# EAGLE design FNIRS_Carrier_BT_Series (EAGLE 9.6.2)

## Sheet 1 of 3
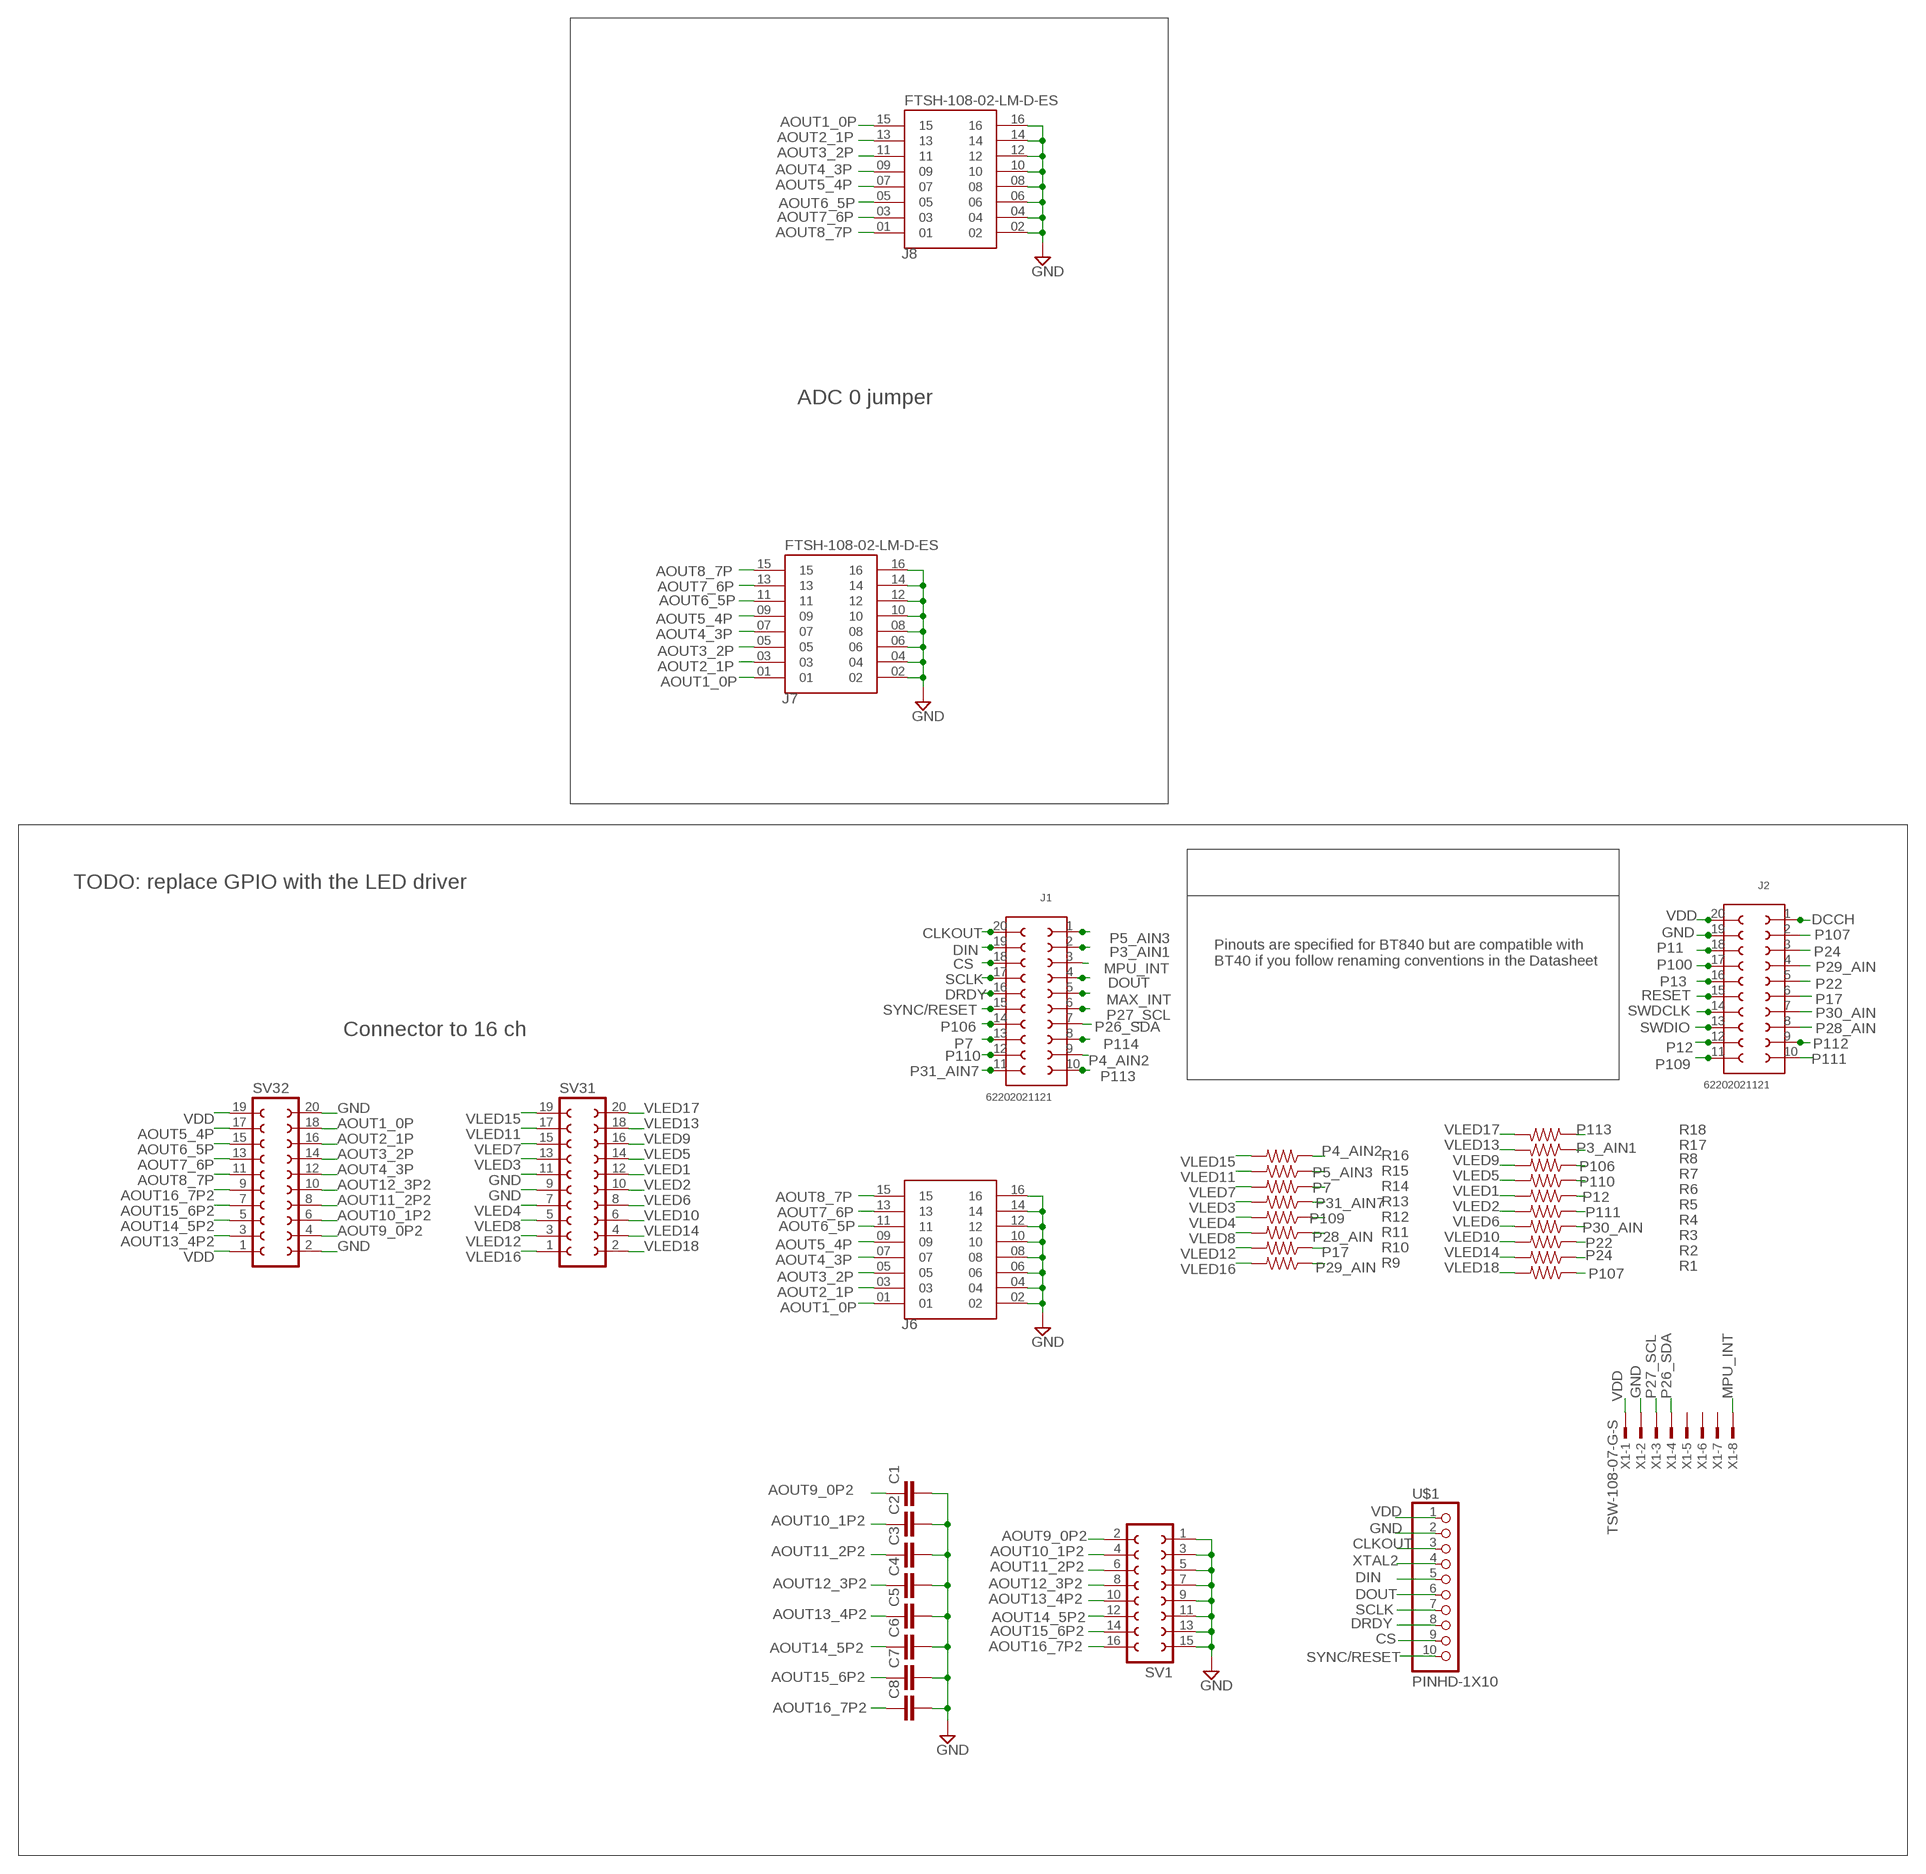
[diagram p0: schematic, sheet 1]

### Parts
C1  C2.5/2  [C2.5-2]
C2  C2.5/2  [C2.5-2]
C3  C2.5/2  [C2.5-2]
C4  C2.5/2  [C2.5-2]
C5  C2.5/2  [C2.5-2]
C6  C2.5/2  [C2.5-2]
C7  C2.5/2  [C2.5-2]
C8  C2.5/2  [C2.5-2]
J1  62202021121  [62202021121]
J2  62202021121  [62202021121]
J6  FTSH-108-02-LM-D-ES  [SAMTEC_FTSH-108-02-LM-D-ES]
J7  FTSH-108-02-LM-D-ES  [SAMTEC_FTSH-108-02-LM-D-ES]
J8  FTSH-108-02-LM-D-ES  [SAMTEC_FTSH-108-02-LM-D-ES]
R1  R-US_0204/5  [0204/5]
R2  R-US_0204/5  [0204/5]
R3  R-US_0204/5  [0204/5]
R4  R-US_0204/5  [0204/5]
R5  R-US_0204/5  [0204/5]
R6  R-US_0204/5  [0204/5]
R7  R-US_0204/5  [0204/5]
R8  R-US_0204/5  [0204/5]
R9  R-US_0204/5  [0204/5]
R10  R-US_0204/5  [0204/5]
R11  R-US_0204/5  [0204/5]
R12  R-US_0204/5  [0204/5]
R13  R-US_0204/5  [0204/5]
R14  R-US_0204/5  [0204/5]
R15  R-US_0204/5  [0204/5]
R16  R-US_0204/5  [0204/5]
R17  R-US_0204/5  [0204/5]
R18  R-US_0204/5  [0204/5]
SV1  FE08-2  [FE08-2]
SV31  FE10-2  [FE10-2]
SV32  FE10-2  [FE10-2]
U$1  PINHD-1X10  [1X10-BIG]
X1  TSW-108-07-G-S  [TSW-108-XX-G-S]

### Nets
AOUT1_0P: J6.01 J7.01 J8.15 SV32.18
AOUT2_1P: J6.03 J7.03 J8.13 SV32.16
AOUT3_2P: J6.05 J7.05 J8.11 SV32.14
AOUT4_3P: J6.07 J7.07 J8.09 SV32.12
AOUT5_4P: J6.09 J7.09 J8.07 SV32.17
AOUT6_5P: J6.11 J7.11 J8.05 SV32.15
AOUT7_6P: J6.13 J7.13 J8.03 SV32.13
AOUT8_7P: J6.15 J7.15 J8.01 SV32.11
AOUT9_0P2: C1.1 SV1.2 SV32.4
AOUT10_1P2: C2.1 SV1.4 SV32.6
AOUT11_2P2: C3.1 SV1.6 SV32.8
AOUT12_3P2: C4.1 SV1.8 SV32.10
AOUT13_4P2: C5.1 SV1.10 SV32.3
AOUT14_5P2: C6.1 SV1.12 SV32.5
AOUT15_6P2: C7.1 SV1.14 SV32.7
AOUT16_7P2: C8.1 SV1.16 SV32.9
CLKOUT: J1.20 U$1.3
CS: J1.18 U$1.9
DCCH: J2.1
DIN: J1.19 U$1.5
DOUT: J1.4 U$1.6
DRDY: J1.16 U$1.8
GND: C1.2 C2.2 C3.2 C4.2 C5.2 C6.2 C7.2 C8.2 J2.19 J6.02 J6.04 J6.06 J6.08 J6.10 J6.12 J6.14 J6.16 J7.02 J7.04 J7.06 J7.08 J7.10 J7.12 J7.14 J7.16 J8.02 J8.04 J8.06 J8.08 J8.10 J8.12 J8.14 J8.16 SV1.1 SV1.3 SV1.5 SV1.7 SV1.9 SV1.11 SV1.13 SV1.15 SV31.9 SV31.11 SV32.2 SV32.20 U$1.2 X1.2
MAX_INT: J1.5
MPU_INT: J1.3 X1.8
P3_AIN1: J1.2 R17.1
P4_AIN2: J1.9 R16.1
P5_AIN3: J1.1 R15.1
P7: J1.13 R14.1
P11: J2.18
P12: J2.12 R6.1
P13: J2.16
P17: J2.6 R10.1
P22: J2.5 R3.1
P24: J2.3 R2.1
P26_SDA: J1.7 X1.4
P27_SCL: J1.6 X1.3
P28_AIN: J2.8 R11.1
P29_AIN: J2.4 R9.1
P30_AIN: J2.7 R4.1
P31_AIN7: J1.11 R13.1
P100: J2.17
P106: J1.14 R8.1
P107: J2.2 R1.1
P109: J2.11 R12.1
P110: J1.12 R7.1
P111: J2.10 R5.1
P112: J2.9
P113: J1.10 R18.1
P114: J1.8
RESET: J2.15
SCLK: J1.17 U$1.7
SWDCLK: J2.14
SWDIO: J2.13
SYNC/RESET: J1.15 U$1.10
VDD: J2.20 SV32.1 SV32.19 U$1.1 X1.1
VLED1: R6.2 SV31.12
VLED2: R5.2 SV31.10
VLED3: R13.2 SV31.13
VLED4: R12.2 SV31.7
VLED5: R7.2 SV31.14
VLED6: R4.2 SV31.8
VLED7: R14.2 SV31.15
VLED8: R11.2 SV31.5
VLED9: R8.2 SV31.16
VLED10: R3.2 SV31.6
VLED11: R15.2 SV31.17
VLED12: R10.2 SV31.3
VLED13: R17.2 SV31.18
VLED14: R2.2 SV31.4
VLED15: R16.2 SV31.19
VLED16: R9.2 SV31.1
VLED17: R18.2 SV31.20
VLED18: R1.2 SV31.2
XTAL2: U$1.4
Unconnected: X1.5 X1.6 X1.7

### Notes on the sheet
- ADC 0 jumper
- TODO: replace GPIO with the LED driver
- Pinouts are specified for BT840 but are compatible with 
  BT40 if you follow renaming conventions in the Datasheet
- Connector to 16 ch

## Sheet 2 of 3

## Sheet 3 of 3

## Library data of the parts
C1-C8 = capacitor-wima:C: CAPACITOR naming: grid - package width
J1 J2 = 2x10_1.27mm:62202021121: WR-PHD 1.27mm Dual Pin Header, 20 Pins=>Code : Con_BTB_PHD_1.27_2_62202021121 <http://katalog.we-online.de/media/thumbs2/eican/thb_Con_BTB_PHD_1.27_2_6220xx21121_pf2.jpg> Details see: http://katalog.we-online.de/en/em/622_0xx_211_21 Created 2014-06-03, Karrer Zheng 2014 (C) Würth Elektronik Check availability <https://pricing.snapeda.com/parts/62202021121/W%C3%BCrth%20Elektronik/view-part?ref=eda>; AVAILABILITY: In Stock; DESCRIPTION: Connector Header Through Hole 20 position 0.050 (1.27mm); MF: Würth Elektronik; MP: 62202021121; PACKAGE: None; PRICE: None; PURCHASE-URL: https://pricing.snapeda.com/search/part/62202021121/?ref=eda
J6-J8 = 16pos1.27mm:FTSH-108-02-LM-D-ES: Check availability <https://pricing.snapeda.com/parts/FTSH-108-02-LM-D-ES/Samtec/view-part?ref=eda>; AVAILABILITY: In Stock; DESCRIPTION: Connector Header Through Hole 16 position 0.050 (1.27mm); MF: Samtec; MP: FTSH-108-02-LM-D-ES; PACKAGE: None; PRICE: None; PURCHASE-URL: https://pricing.snapeda.com/search?q=FTSH-108-02-LM-D-ES&ref=eda
R1-R18 = rcl:R-US_: RESISTOR, American symbol; SPICEPREFIX: R
SV1 = con-lsta:FE08-2: FEMALE HEADER; OC_FARNELL: unknown; OC_NEWARK: unknown
SV31 SV32 = con-lsta:FE10-2: FEMALE HEADER; OC_FARNELL: unknown; OC_NEWARK: unknown
U$1 = adafruit:PINHD-1X10: Pin header 1x10 0.1" spacing With round pins
X1 = con-samtec:TSW-108-*-G-S: THROUGH-HOLE .025" SQ POST HEADER Source: Samtec TSW.pdf; MF: Samtec Inc.; MPN: TSW-108-07-G-S

## Board
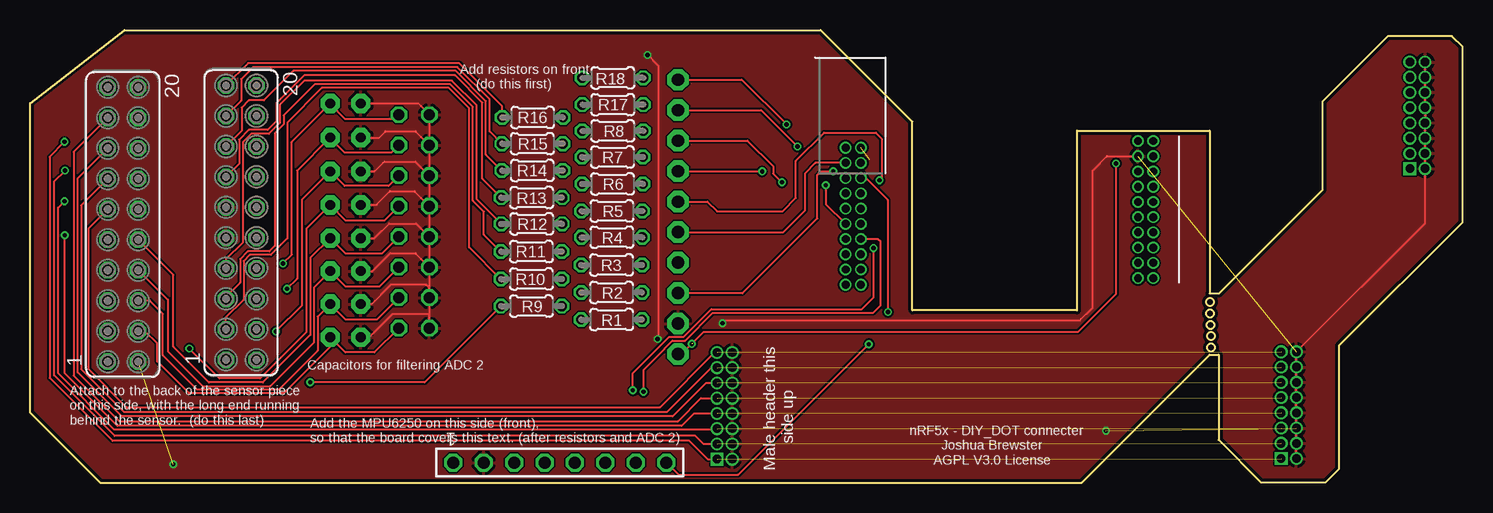
[diagram p1: board, top side]
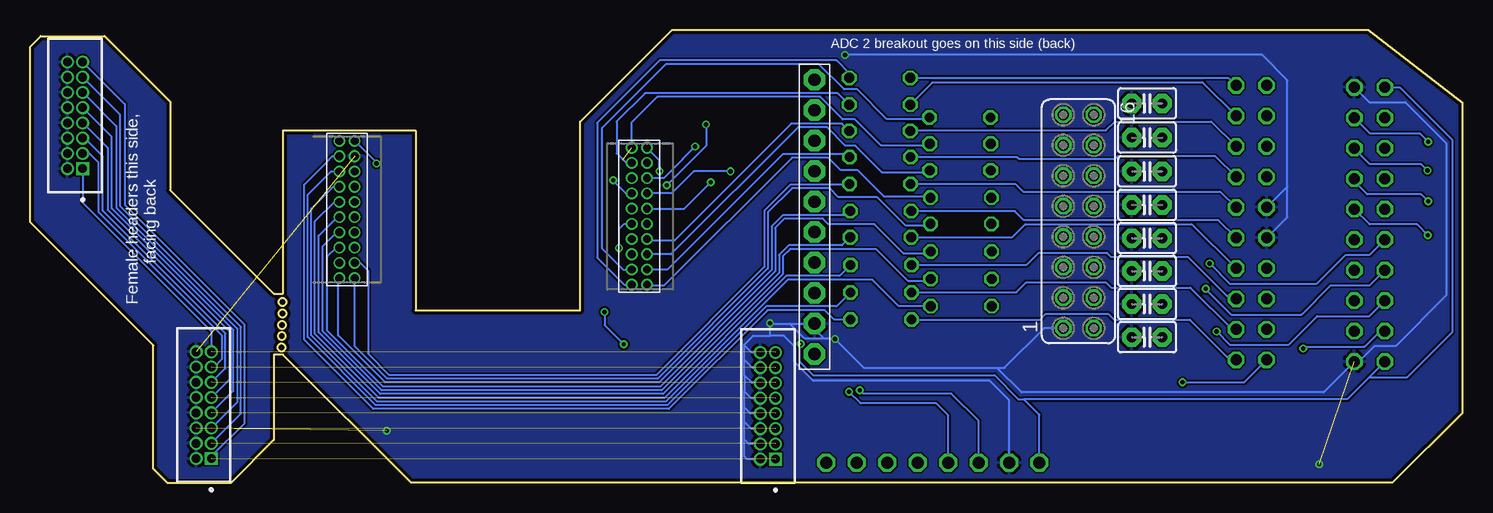
[diagram p2: board, bottom side, seen from below]

Size 119.38 x 37.72 mm. Coordinates in mm from the lower left corner, seen from the top.
Outline: 0,31.62 7.87,37.72 65.89,37.72 73.53,30.07 73.53,14.35 87.25,14.35 87.25,29.34 98.3,29.34 98.3,15.75 99.06,15.75 107.7,24.38 107.7,31.75 113.16,37.21 118.49,37.21 119.38,36.32 119.38,21.72 109.09,11.43 109.09,1.14 107.95,0 102.62,0 99.06,3.56 99.06,10.67 98.3,10.67 87.63,0 5.84,0 0,5.84 0,31.62
Outline: circle at 98.32,15.06 radius 0.32
Outline: circle at 98.32,14.1 radius 0.32
Outline: circle at 98.37,13.13 radius 0.32
Outline: circle at 98.4,12.22 radius 0.32
Outline: circle at 98.42,11.28 radius 0.32
Copper layers (1*16): Top 0.035mm / dielectric 1.5mm / Bottom 0.035mm
Design rules "default *": minimum track width 4mil, minimum drill 0.2mm, track to track 6mil, track to pad 6mil, pad to pad 6mil, via to via 6mil, smd to smd 6mil, copper to edge 10mil, drill to drill 6mil, minimum pad ring 6mil, minimum via ring 6mil, stop-mask expansion 4mil, vias tented up to drill 20mil, thermal gap 10mil

### Footprints (pad centres in the part's own frame; a part is rotated, then mirrored left to right if it is on the bottom)
C2.5-2 = drill 0.813 pad 1.6 octagon: 1 -1.27,0; 2 1.27,0
62202021121 = drill 0.65: 1 -5.715,-0.635; 2 -4.445,-0.635; 3 -3.175,-0.635; 4 -1.905,-0.635; 5 -0.635,-0.635; 6 0.635,-0.635; 7 1.905,-0.635; 8 3.175,-0.635; 9 4.445,-0.635; 10 5.715,-0.635; 11 5.715,0.635; 12 4.445,0.635; 13 3.175,0.635; 14 1.905,0.635; 15 0.635,0.635; 16 -0.635,0.635; 17 -1.905,0.635; 18 -3.175,0.635; 19 -4.445,0.635; 20 -5.715,0.635
SAMTEC_FTSH-108-02-LM-D-ES = drill 0.71 pad 1.06 square: 01 0,0 | drill 0.71 pad 1.06: 02 0,1.27; 03 1.27,0; 04 1.27,1.27; 05 2.54,0; 06 2.54,1.27; 07 3.81,0; 08 3.81,1.27; 09 5.08,0; 10 5.08,1.27; 11 6.35,0; 12 6.35,1.27; 13 7.62,0; 14 7.62,1.27; 15 8.89,0; 16 8.89,1.27
0204/5 = drill 0.813 octagon: 1 -2.54,0; 2 2.54,0
FE08-2 = drill 0.914 octagon: 1 -8.89,1.27; 2 -8.89,-1.27; 3 -6.35,1.27; 4 -6.35,-1.27; 5 -3.81,1.27; 6 -3.81,-1.27; 7 -1.27,1.27; 8 -1.27,-1.27; 9 1.27,1.27; 10 1.27,-1.27; 11 3.81,1.27; 12 3.81,-1.27; 13 6.35,1.27; 14 6.35,-1.27; 15 8.89,1.27; 16 8.89,-1.27
FE10-2 = drill 0.914 octagon: 1 -11.43,1.27; 2 -11.43,-1.27; 3 -8.89,1.27; 4 -8.89,-1.27; 5 -6.35,1.27; 6 -6.35,-1.27; 7 -3.81,1.27; 8 -3.81,-1.27; 9 -1.27,1.27; 10 -1.27,-1.27; 11 1.27,1.27; 12 1.27,-1.27; 13 3.81,1.27; 14 3.81,-1.27; 15 6.35,1.27; 16 6.35,-1.27; 17 8.89,1.27; 18 8.89,-1.27; 19 11.43,1.27; 20 11.43,-1.27
1X10-BIG = drill 1.016 pad 1.778 octagon: 1 -11.43,0; 2 -8.89,0; 3 -6.35,0; 4 -3.81,0; 5 -1.27,0; 6 1.27,0; 7 3.81,0; 8 6.35,0; 9 8.89,0; 10 11.43,0
TSW-108-XX-G-S = drill 1 pad 1.5 octagon: 1 8.89,0; 2 6.35,0; 3 3.81,0; 4 1.27,0; 5 -1.27,0; 6 -3.81,0; 7 -6.35,0; 8 -8.89,0

### Placement (x,y rotation side)
C1  26.29,12.12 180 bottom
C2  26.29,14.88 180 bottom
C3  26.29,17.63 180 bottom
C4  26.29,20.37 180 bottom
C5  26.29,23.14 180 bottom
C6  26.29,25.93 180 bottom
C7  26.29,28.75 180 bottom
C8  26.29,31.6 180 bottom
J1  68.61,22.2 270 bottom
J2  92.96,22.76 270 bottom
J6  57.25,1.96 90 bottom
J7  104.27,2.01 90 bottom
J8  114.99,26.16 90 bottom
R1  48.46,13.59 180 top
R2  48.46,15.85 180 top
R3  48.46,18.14 180 top
R4  48.49,20.45 180 top
R5  48.49,22.63 180 top
R6  48.54,24.89 180 top
R7  48.54,27.13 180 top
R8  48.56,29.31 180 top
R9  41.78,14.71 180 top
R10  41.78,16.97 180 top
R11  41.78,19.25 180 top
R12  41.81,21.56 180 top
R13  41.81,23.75 180 top
R14  41.86,26.01 180 top
R15  41.86,28.24 180 top
R16  41.88,30.43 180 top
R17  48.56,31.5 180 top
R18  48.56,33.73 180 top
SV1  32,21.77 90 bottom
SV31  17.6,21.67 90 top
SV32  7.75,21.51 90 top
U$1  54,22.15 90 bottom
X1  44.15,1.68 180 top

### Tracks (layer width: path | path; a pad name or v marks a point on that pad's centre or on a via)
AOUT1_0P  (via drill 0.35)  (1 unrouted)
  Top 0.152: v2.87,28.4 1.63,27.15 1.63,8.74 6.88,3.48 54.94,3.48 56.46,1.96 J6.01
  Bottom 0.152: SV32.18 7.72,29.11 3.58,29.11 v2.87,28.4 | J8.15 111.48,31.55 111.48,23.14 101.5,13.16 101.5,4.97 104.27,2.2 J7.01
AOUT2_1P  (via drill 0.35)  (1 unrouted)
  Top 0.152: v2.92,26.01 2.01,25.1 2.01,8.94 7.06,3.89 55.45,3.89 56.11,3.23 J6.03
  Bottom 0.152: v2.92,26.01 3.45,26.54 7.72,26.54 9.02,27.84 SV32.16 | J7.03 101.8,5.74 101.8,12.98 111.86,23.04 111.86,30.66 J8.13
AOUT3_2P  (via drill 0.35)  (1 unrouted)
  Top 0.152: v2.87,23.44 2.34,22.91 2.34,9.12 7.04,4.42 57.17,4.42 J6.05
  Bottom 0.152: v2.87,23.44 3.45,24.03 7.95,24.03 9.02,25.1 SV32.14 | J8.11 112.19,29.72 112.19,22.91 102.11,12.83 102.11,6.71 J7.05
AOUT4_3P  (via drill 0.35)  (1 unrouted)
  Top 0.152: v2.9,20.62 2.87,20.6 2.87,9.15 7.29,4.72 54.3,4.72 55.35,5.77 J6.07
  Bottom 0.152: v2.9,20.62 3.78,21.51 7.75,21.51 SV32.12 | J7.07 102.44,7.65 102.44,12.73 112.57,22.86 112.57,28.83 J8.09
AOUT5_4P  (1 unrouted)
  Top 0.152: SV32.17 3.63,27.56 3.63,8.92 7.42,5.13 54,5.13 55.9,7.04 J6.09
  Bottom 0.152: J8.07 112.9,27.89 112.9,22.73 102.77,12.6 102.77,8.59 J7.09
AOUT6_5P  (1 unrouted)
  Top 0.152: SV32.15 3.96,25.35 3.96,9.2 7.64,5.51 53.54,5.51 56.34,8.31 J6.11
  Bottom 0.152: J7.11 103.1,9.53 103.1,12.45 113.31,22.66 113.31,27.18 114.83,28.7 J8.05
AOUT7_6P  (1 unrouted)
  Top 0.152: SV32.13 4.27,23.11 4.27,9.45 7.82,5.89 53.09,5.89 56.77,9.58 J6.13
  Bottom 0.152: J8.03 114.43,27.43 113.69,26.7 113.69,22.58 103.4,12.29 103.4,10.26 104.04,9.63 J7.13
AOUT8_7P  (1 unrouted)
  Top 0.152: SV32.11 4.88,21.18 4.88,9.45 8.03,6.3 52.5,6.3 57.05,10.85 J6.15
  Bottom 0.152: J8.01 114.99,23.34 104.27,12.62 J7.15
AOUT9_0P2
  Top 0.152: SV32.4 9.58,12.62 10.59,11.61 10.59,10.11 13.26,7.44 21.16,7.44 25.02,11.3 C1.1 26.29,10.85 28.7,10.85 SV1.2
AOUT10_1P2
  Top 0.152: SV32.6 9.98,15.16 11.07,14.07 11.07,10.62 13.94,7.75 20.73,7.75 23.98,11 23.98,13.84 C2.1 26.31,13.59 28.91,13.59 SV1.4
AOUT11_2P2
  Top 0.152: SV32.8 11.48,15.24 11.48,10.95 14.38,8.05 20.02,8.05 23.67,11.71 23.67,16.28 C3.1 26.31,16.33 29.11,16.33 SV1.6
AOUT12_3P2
  Top 0.152: SV32.10 11.94,17.32 11.94,11.33 14.91,8.36 19.41,8.36 23.37,12.32 23.37,18.72 C4.1 26.31,19.08 29.31,19.08 SV1.8
AOUT13_4P2  (via drill 0.35)
  Top 0.152: v13.28,11.18 15.77,8.69 19.18,8.69 23.04,12.55 23.04,21.16 C5.1 26.31,21.84 29.54,21.84 SV1.10
  Bottom 0.152: v13.28,11.18 13.13,11.33 8.15,11.33 6.86,12.62 SV32.3
AOUT14_5P2  (via drill 0.35)
  Top 0.152: v20.5,12.6 22.66,14.76 22.66,23.57 C6.1 26.21,24.74 29.9,24.74 SV1.12
  Bottom 0.152: SV32.5 7.77,13.87 12.12,13.87 14.48,11.51 19.41,11.51 v20.5,12.6
AOUT15_6P2  (via drill 0.35)
  Top 0.152: C7.1 24.99,28.75 | 24.99,28.75 22.25,26.01 22.25,16.99 v21.41,16.15 | SV1.14 30.12,27.51 26.24,27.51 24.99,28.75
  Bottom 0.152: v21.41,16.15 21.41,16.13 19.28,14 13.41,14 10.97,16.43 7.75,16.43 SV32.7
AOUT16_7P2  (via drill 0.35)
  Top 0.152: SV1.16 30.38,30.3 26.29,30.3 25.02,31.57 C8.1 21.82,28.4 21.82,19 v21.08,18.26
  Bottom 0.152: v21.08,18.26 19.38,16.56 12.17,16.56 9.75,18.97 7.75,18.97 SV32.9
CLKOUT  (via drill 0.35)
  Top 0.152: U$1.3 54.03,15.77 59.36,15.77 65.61,22.02 65.61,25.63 65.92,25.94 v66.92,25.94
  Bottom 0.152: v66.92,25.94 66.92,26.87 J1.20
CS  (via drill 0.35)
  Top 0.152: U$1.9 60.93,31.04 v63.96,28.02
  Bottom 0.152: v63.96,28.02 65,26.98 65,26.95 66.57,25.38 J1.18
DIN
  Top 0.152: U$1.5 62.79,20.88 64.59,22.68 64.59,25.78 65.46,26.65 J1.19
DOUT  (via drill 0.35)
  Top 0.152: U$1.6 56.44,23.42 57.25,22.61 62.71,22.61 63.83,23.72 63.83,26.82 66.17,29.16 70.48,29.16 70.99,28.65 70.99,25.38 70.81,25.2 v70.79,25.2
  Bottom 0.152: J1.4 69.72,24.11 70.79,25.17 v70.79,25.2
DRDY  (via drill 0.35)
  Top 0.152: 54.63,28.5 U$1.8 59.79,28.5 61.92,26.37 61.92,25.76 v62.66,25.02
  Bottom 0.152: v62.66,25.02 64.87,22.81 67.94,22.81 J1.16
GND  (via drill 0.35)  (3 unrouted)
  Top 0.152: C1.2 28.27,12.12 30.2,14.05 33.27,14.05 SV1.1 SV1.3 | SV1.3 33.27,16.23 33.02,16.49 30.07,16.49 28.47,14.88 C2.2 | C3.2 28.52,17.63 30.02,19.13 32.11,19.13 SV1.5 | C4.2 28.7,20.37 29.92,21.59 32.18,21.59 SV1.7 | C5.2 28.85,23.14 30,24.28 32.03,24.28 SV1.9 | C6.2 28.73,25.93 29.54,26.75 32.11,26.75 SV1.11 | C7.2 29.11,28.75 29.64,29.29 32.11,29.29 SV1.13 | C8.2 32.33,31.6 SV1.15 SV1.13 | v51.46,35.64 52.35,34.75 52.35,12.02 v52.3,11.97 | SV1.13 SV1.11 | SV1.11 SV1.9 | SV1.9 SV1.7 | SV1.7 SV1.5 | SV1.5 SV1.3 | v57.71,13.28 57.94,13.51 87.48,13.51 88.54,14.58 88.54,26.01 89.74,27.2 J2.19 | J8.16 J8.14 J8.12 J8.10 J8.08 J8.06 J8.04 J8.02 116.26,21.62 J7.16 J7.14 J7.12 J7.10 J7.08 J7.06 J7.04 J7.02
  Bottom 0.152: SV31.11 14.6,24.66 | 14.6,24.66 14.6,33.53 16.71,35.64 v51.46,35.64 | 59.87,3.61 59.87,5.08 | 59.87,5.08 59.87,6.27 | 59.87,5.08 59.28,4.5 J6.06 | 59.87,6.27 59.36,5.77 J6.08 | 59.87,7.62 59.28,7.04 J6.10 | 59.87,3.61 59.49,3.23 J6.04 | SV32.20 7.77,31.7 4.77,31.7 1.37,28.3 1.37,15.6 5.59,11.38 7.34,11.38 8.64,10.08 SV32.2 11.58,7.52 36.75,7.52 38.8,9.56 | SV31.9 14.6,22.12 14.6,24.66 | X1.2 37.79,6.88 39.39,8.48 54.1,8.48 55.7,10.08 55.7,11.38 56.57,12.24 57.71,12.24 | 38.8,9.56 49.89,9.56 v52.3,11.97 52.33,12.01 53.19,12.01 | 38.8,9.56 38.19,9.56 34.87,12.88 SV1.1 | 53.19,12.01 53.97,12.79 53.97,13.21 54.02,13.26 U$1.2 56.06,13.26 | 59.87,8.97 59.87,7.62 | 59.87,11.46 59.87,11.5 59.12,12.24 57.71,12.24 | 56.06,13.26 57.68,13.26 v57.71,13.28 57.71,12.24 | 53.19,12.01 54.8,12.01 56.06,13.26 | 59.87,11.46 59.28,10.87 58.55,10.87 J6.16 | 59.87,3.61 59.87,2.21 59.61,1.96 J6.02 | 59.87,8.97 59.21,8.31 J6.12 | 59.87,6.27 59.87,7.62 | 59.87,8.97 59.87,10.24 | 59.87,10.24 59.87,11.46 | J6.14 59.21,9.58 59.87,10.24
  other vias: 11.94,1.52 89.66,4.32
  pour Bottom: -1.78,39.12 -1.78,-1.27 121.92,-1.27 121.92,39.12
  pour Top: -7.11,12.19 -7.11,-2.29 103.38,-2.29 123.19,-2.29 123.19,41.15 -7.11,41.15
MPU_INT  (via drill 0.35)
  Top 0.152: X1.8 54.05,0.66 59.02,0.66 v69.89,11.53 v69.9,11.53 | v71.5,14.22 71.48,14.25 71.48,23.57 69.67,25.38 J1.3
  Bottom 0.152: v71.5,14.22 71.5,13.13 v69.9,11.53
P3_AIN1
  Bottom 0.152: R17.1 52.07,32.46 68.12,32.46 70.48,30.1 70.48,27.43 69.7,26.65 J1.2
P4_AIN2
  Bottom 0.152: R16.1 44.55,30.3 47.96,30.3 50.43,32.77 51.53,32.77 53.64,34.87 66.39,34.87 71.73,29.54 71.73,19.53 69.95,17.76 J1.9
P5_AIN3  (1 unrouted)
  Bottom 0.152: R15.1 44.53,28.12 48.47,28.12 50.63,30.28 51.66,30.28 53.54,32.16 67.11,32.16 69.27,30 69.27,27.94 J1.1
P7
  Bottom 0.152: R14.1 44.53,25.88 48.39,25.88 50.6,28.09 51.43,28.09 52.96,29.62 55.37,29.62 65.96,19.03 J1.13
P12
  Bottom 0.152: R6.1 51.08,24.84 56.01,24.84 58.19,22.66 58.19,17.98 67.2,8.97 89.43,8.97 91.21,10.74 91.21,17.65 91.87,18.31 J2.12
P17
  Bottom 0.152: R10.1 44.45,16.84 46.25,16.84 48.87,19.46 56.03,19.46 56.64,18.85 56.64,17.37 66.62,7.39 90.2,7.39 95.33,12.52 95.33,20.57 93.78,22.12 J2.6
P22
  Bottom 0.152: R3.1 51.92,17.22 56.36,17.22 66.49,7.09 90.32,7.09 95.63,12.39 95.63,21.77 94,23.39 J2.5
P24
  Bottom 0.152: R2.1 52.17,14.68 58.04,14.68 66.27,6.45 90.55,6.45 96.24,12.14 96.24,23.98 94.28,25.93 J2.3
P26_SDA  (via drill 0.35)
  Top 0.152: v51.13,7.57 51.13,9.4 52.88,11.15 52.88,11.18 53.54,11.84 54.59,11.84 56.9,14.15 70.25,14.15 70.88,14.77 70.88,20.08 70.66,20.3 J1.7
  Bottom 0.152: X1.4 42.87,5.61 43.87,6.6 50.16,6.6 v51.13,7.57
P27_SCL  (via drill 0.35)
  Top 0.152: v50.24,7.7 50.24,9.12 53.26,12.14 54.46,12.14 56.77,14.45 69.32,14.45 70.3,15.44 v70.3,19.54 v70.29,19.55
  Bottom 0.152: X1.3 40.33,5.16 42.6,7.42 49.96,7.42 v50.24,7.7 | v70.29,19.55 70.29,21.15 69.88,21.57 J1.6
P28_AIN
  Bottom 0.152: R11.1 44.45,19.13 46.61,19.13 49.02,21.54 52.86,21.54 53.31,22 56.51,22 57.28,21.23 57.28,17.6 66.87,8 89.94,8 94.59,12.65 94.59,18.85 93.85,19.58 J2.8
P29_AIN
  Bottom 0.152: R9.1 46.96,14.71 49.17,16.92 56.23,16.92 66.39,6.76 90.42,6.76 95.94,12.27 95.94,22.83 94.11,24.66 J2.4
P30_AIN
  Bottom 0.152: R4.1 51.71,19.76 56.16,19.76 56.95,18.97 56.95,17.5 66.75,7.7 90.07,7.7 94.97,12.6 94.97,19.71 93.83,20.85 J2.7
P31_AIN7
  Bottom 0.152: R13.1 44.42,23.83 48.21,23.83 50.42,26.04 51.83,26.04 52.87,27.08 55.88,27.08 66.55,16.41 67.89,16.41 J1.11
P106
  Bottom 0.152: R8.1 51.71,29.92 55.96,29.92 65.71,20.17 67.84,20.17 J1.14
P107
  Bottom 0.152: R1.1 52.37,13.59 53.16,14.38 57.91,14.38 66.14,6.15 90.78,6.15 96.55,11.91 96.55,24.84 94.46,26.92 94.41,26.98 94.18,27.2 J2.2
P109
  Bottom 0.152: R12.1 44.47,21.44 46.43,21.44 48.79,23.8 52.01,23.8 52.75,24.54 55.88,24.54 57.89,22.53 57.89,17.85 67.07,8.66 89.62,8.66 92.33,11.37 J2.11
P110
  Bottom 0.152: R7.1 51.1,27.13 51.35,27.38 56.64,27.38 66.27,17.76 J1.12
P111
  Bottom 0.152: R5.1 51.36,22.3 56.64,22.3 57.58,21.36 57.58,17.72 66.95,8.36 89.79,8.36 93.7,12.26 93.7,16.94 J2.10
P113
  Bottom 0.152: R18.1 51.1,34.11 52.17,35.18 66.9,35.18 72.11,29.97 72.11,18.75 69.85,16.49 J1.10
SCLK  (via drill 0.35)
  Top 0.152: v61.01,25.93 60.98,25.96 U$1.7
  Bottom 0.152: v61.01,25.93 64.06,25.93 65.89,24.11 J1.17
SYNC/RESET  (via drill 0.35)
  Top 0.152: v63.04,29.85 59.31,33.58 U$1.10 | v66.32,24.79 66.32,23.22 J1.15
  Bottom 0.152: v63.04,29.85 63.04,28.07 v66.32,24.79
VDD  (via drill 0.35)  (1 unrouted)
  Top 0.152: U$1.1 54.3,10.72 v55.15,11.56 56.16,12.57 87.35,12.57 90.5,15.72 v90.5,26.59
  Bottom 0.152: SV32.1 7.81,8.75 | 7.81,8.75 9.6,6.96 36.55,6.96 | 36.55,6.96 37.01,6.96 39,8.95 54.11,8.95 55.25,10.09 55.25,11.56 | SV32.19 5.23,32.94 0.86,28.58 0.86,12.52 4.63,8.75 7.81,8.75 | X1.1 35.25,5.66 36.55,6.96 | v90.5,26.59 90.5,26.65 J2.20
VLED1
  Bottom 0.152: R6.2 37.26,24.89 36.62,24.26 20.19,24.26 SV31.12
VLED2
  Bottom 0.152: R5.2 37.31,22.63 36.55,21.87 20.34,21.87 SV31.10
VLED3
  Top 0.152: R13.2 37.69,25.32 37.69,31.68 35.42,33.95 22.85,33.95 20.52,31.62 20.52,30.1 19.81,29.39 18.24,29.39 17.42,28.58 17.42,26.57 SV31.13
VLED4
  Top 0.152: R12.2 37.21,23.62 37.21,31.45 35.15,33.5 22.86,33.5 20.83,31.47 20.83,29.97 19.91,29.06 18.42,29.06 17.73,28.37 17.73,19.99 16.33,18.6 SV31.7
VLED5
  Bottom 0.152: R7.2 37.13,27.13 36.95,26.95 28.99,26.95 28.72,27.22 20.61,27.22 SV31.14
VLED6
  Bottom 0.152: R4.2 37.54,20.45 36.43,21.55 22.57,21.55 SV31.8
VLED7
  Top 0.152: R14.2 38,27.33 38,31.8 35.48,34.32 21.95,34.32 19.48,31.85 18.24,31.85 17.63,31.24 17.63,29.31 SV31.15
VLED8
  Top 0.152: R11.2 37.82,20.68 37.82,22.58 36.91,23.5 36.91,31.32 35.03,33.2 23.72,33.2 21.13,30.61 21.13,29.85 20.4,29.11 20.4,19.74 19.94,19.28 18.16,19.28 17.5,18.62 17.5,16.66 16.33,15.49 SV31.5
VLED9
  Bottom 0.152: R8.2 45.97,29.36 29.72,29.36 29,30.09 20.94,30.09 SV31.16
VLED10
  Bottom 0.152: R3.2 36.34,18.14 35.3,19.18 29.64,19.18 29.26,18.8 22.86,18.8 19.38,15.32 SV31.6
VLED11
  Top 0.152: R15.2 38.3,29.26 38.3,31.93 35.61,34.62 18.59,34.62 17.6,33.63 17.6,31.83 SV31.17
VLED12
  Top 0.152: R10.2 36.6,19.61 36.6,31.19 34.9,32.89 24.33,32.89 21.44,30 21.44,20.35 20.06,18.97 18.32,18.97 17.8,18.46 17.8,15.24 16.33,13.77 SV31.3
VLED13
  Bottom 0.152: SV31.18 21.64,33.33 44.2,33.33 R17.2
VLED14
  Bottom 0.152: R2.2 37.18,15.85 36.34,16.69 29.72,16.69 29.29,16.26 22.68,16.26 19.2,12.78 SV31.4
VLED15
  Top 0.152: R16.2 39.34,31.37 35.76,34.95 18.19,34.95 SV31.19
VLED16  (via drill 0.35)
  Top 0.152: R9.2 32.89,8.36 v23.34,8.36
  Bottom 0.152: v23.34,8.36 18.21,8.36 SV31.1
VLED17
  Bottom 0.152: R18.2 19.51,33.73 SV31.20
VLED18
  Bottom 0.152: SV31.2 19.38,10.24 22.73,13.59 29.03,13.59 29.52,14.07 34.72,14.07 35.2,13.59 R1.2

### Text on the board
tNames: Add resistors on front / (do this first) | Capacitors for filtering ADC 2 | Attach to the back of the sensor piece / on this side, with the long end running / behind the sensor. (do this last) | Add the MPU6250 on this side (front), / so that the board covers this text. (after resistors and ADC 2) | Male header this / side up | nRF5x - DIY_DOT connecter / Joshua Brewster / AGPL V3.0 License
bNames: ADC 2 breakout goes on this side (back) | Female headers this side, / facing back
Measures: Includes ADS131M08 breakout at / https://github.com/joshbrew/ads131m08_arduino / / And a stock MPU6250 breakout / / Recommend 220pF caps / and 150Ohm Resistors